# EAGLE design buttons2 (EAGLE 6.5.0)
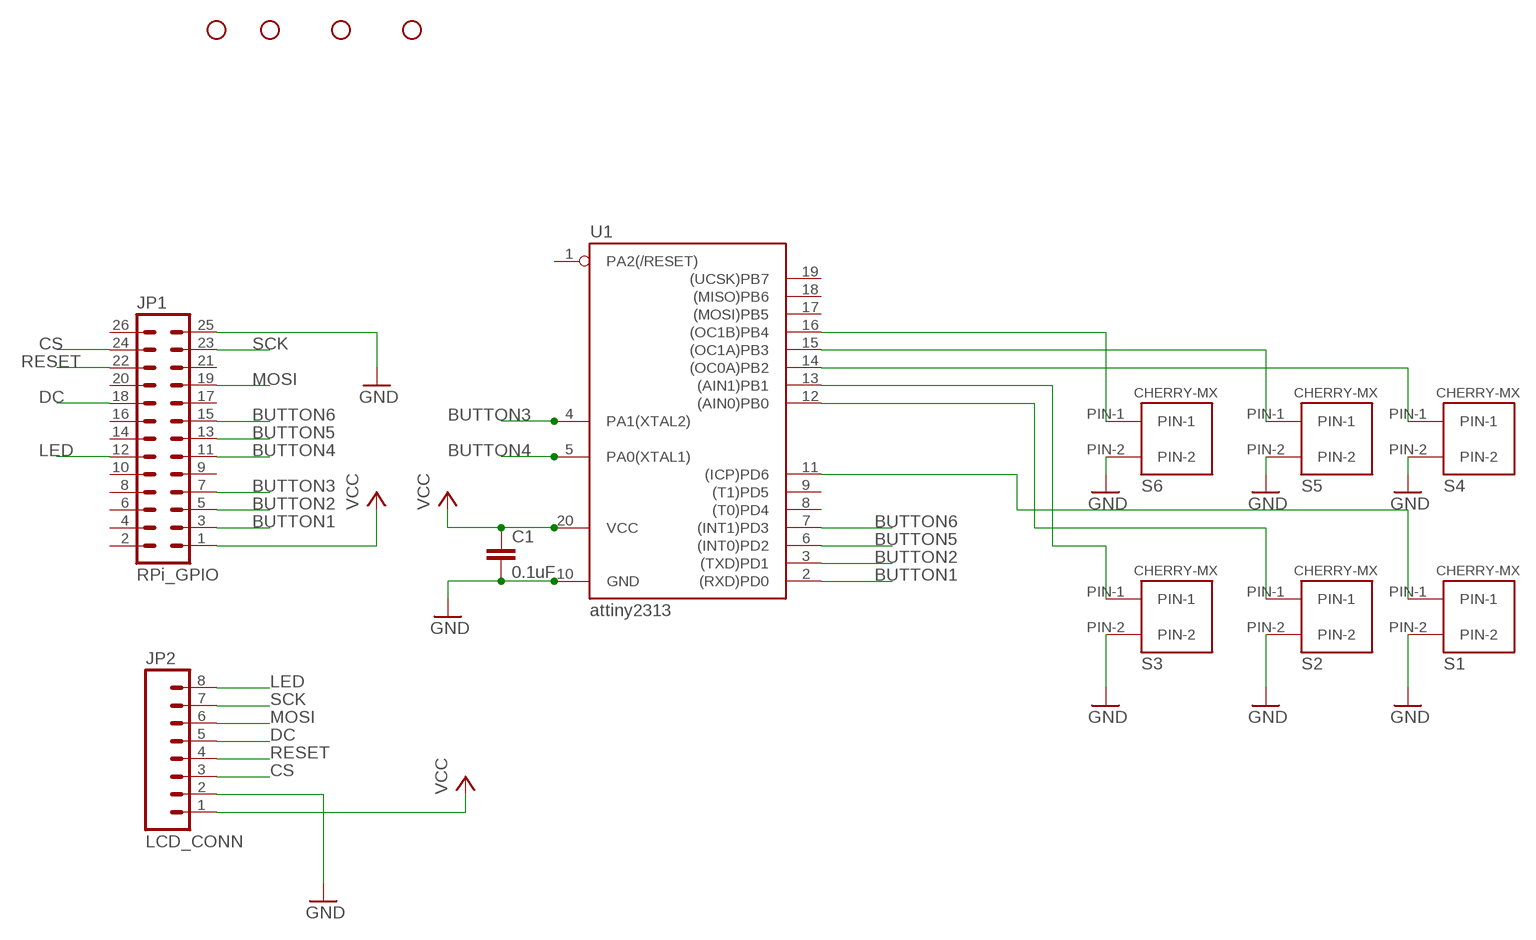
[diagram p0: schematic, sheet 1]

## Parts
C1  0.1uF  C2.5/2  [C2.5-2]
JP1  RPi_GPIO  ML26  [ML26]
JP2  LCD_CONN  M081X08  [1X08]
S1  CHERRY-MX-I  [CHERRY-MX-I]
S2  CHERRY-MX-I  [CHERRY-MX-I]
S3  CHERRY-MX-I  [CHERRY-MX-I]
S4  CHERRY-MX-I  [CHERRY-MX-I]
S5  CHERRY-MX-I  [CHERRY-MX-I]
S6  CHERRY-MX-I  [CHERRY-MX-I]
STANDOFF1  STAND-OFF  [STAND-OFF]
STANDOFF2  STAND-OFF  [STAND-OFF]
STANDOFF3  STAND-OFF  [STAND-OFF]
STANDOFF4  STAND-OFF  [STAND-OFF]
U1  attiny2313  TINY2313-*P*  [DIL20]

## Nets
BUTTON1: JP1.3 U1.2((RXD)PD0)
BUTTON2: JP1.5 U1.3((TXD)PD1)
BUTTON3: JP1.7 U1.4(PA1(XTAL2))
BUTTON4: JP1.11 U1.5(PA0(XTAL1))
BUTTON5: JP1.13 U1.6((INT0)PD2)
BUTTON6: JP1.15 U1.7((INT1)PD3)
CS: JP1.24 JP2.3
DC: JP1.18 JP2.5
GND: C1.2 JP1.25 JP2.2 S1.PIN-2 S2.PIN-2 S3.PIN-2 S4.PIN-2 S5.PIN-2 S6.PIN-2 U1.10(GND)
LED: JP1.12 JP2.8
MOSI: JP1.19 JP2.6
N$1: S6.PIN-1 U1.16((OC1B)PB4)
N$2: S5.PIN-1 U1.15((OC1A)PB3)
N$3: S4.PIN-1 U1.14((OC0A)PB2)
N$4: S3.PIN-1 U1.13((AIN1)PB1)
N$5: S2.PIN-1 U1.12((AIN0)PB0)
N$6: S1.PIN-1 U1.11((ICP)PD6)
RESET: JP1.22 JP2.4
SCK: JP1.23 JP2.7
VCC: C1.1 JP1.1 JP2.1 U1.20(VCC)
Unconnected: JP1.2 JP1.4 JP1.6 JP1.8 JP1.9 JP1.10 JP1.14 JP1.16 JP1.17 JP1.20 JP1.21 JP1.26 U1.1(PA2(/RESET)) U1.8((T0)PD4) U1.9((T1)PD5) U1.17((MOSI)PB5) U1.18((MISO)PB6) U1.19((UCSK)PB7)

## Library data of the parts
C1 = capacitor-wima:C: CAPACITOR naming: grid - package width
JP1 = con-harting-ml:ML26: HARTING; OC_FARNELL: unknown; OC_NEWARK: unknown
JP2 = SparkFun-Connectors:M08: Header 8 Standard 8-pin 0.1" header. Use with straight break away headers (SKU : PRT-00116), right angle break away headers (PRT-00553), swiss pins (PRT-00743), machine pins (PRT-00117), and female headers (PRT-00115).
S1-S6 = cherrymx:CHERRY-MX-I
STANDOFF1-STANDOFF4 = SparkFun-Electromechanical:STAND-OFF: #4 Stand Off This is the mechanical footprint for a #4 phillips button head screw. Use the keepout ring to avoid running the screw head into surrounding components. SKU : PRT-00447
U1 = avr-6:TINY2313*: Atmel Tiny2313 2K Flash, 128 bytes EEPROM, 128 bytes RAM

## Board
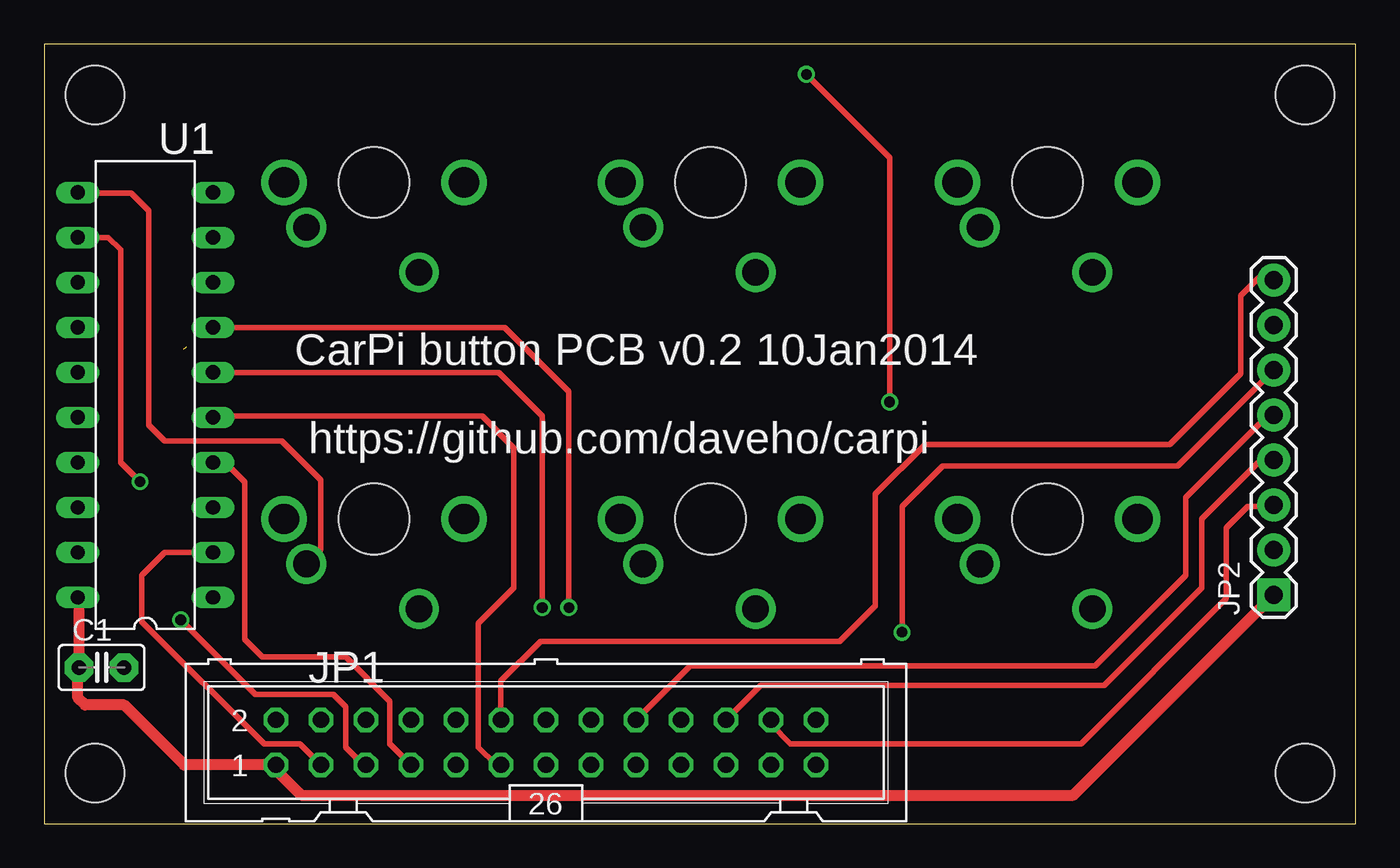
[diagram p1: board, top side]
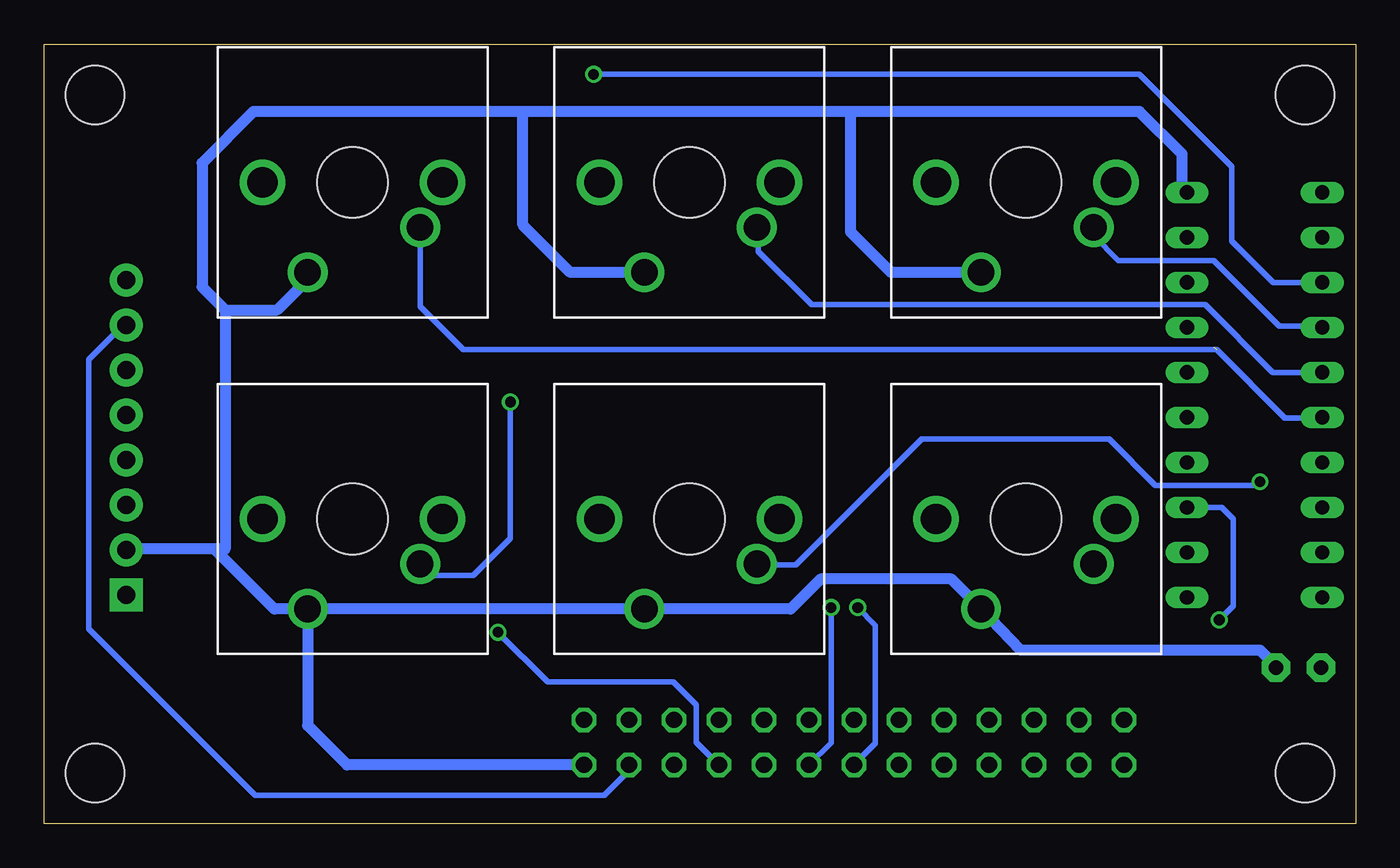
[diagram p2: board, bottom side, seen from below]

Size 74 x 44 mm. Coordinates in mm from the lower left corner, seen from the top.
Outline: 0,0 74,0 74,44 0,44 0,0
Copper layers (1*16): Top 0.0356mm / dielectric 1.5011mm / Bottom 0.0356mm
Design rules "LaenPCBOrder": minimum track width 6mil, minimum drill 13mil, track to track 6mil, track to pad 6mil, pad to pad 6mil, via to via 6mil, smd to smd 6mil, copper to edge 15mil, drill to drill 6mil, minimum pad ring 7mil, minimum via ring 7mil, stop-mask expansion 3mil, vias tented up to drill 0mil, thermal gap 10mil

### Footprints (pad centres in the part's own frame; a part is rotated, then mirrored left to right if it is on the bottom)
C2.5-2 = drill 0.813 pad 1.6 octagon: 1 -1.27,0; 2 1.27,0
ML26 = drill 0.914 octagon: 1 -15.24,-1.27; 2 -15.24,1.27; 3 -12.7,-1.27; 4 -12.7,1.27; 5 -10.16,-1.27; 6 -10.16,1.27; 7 -7.62,-1.27; 8 -7.62,1.27; 9 -5.08,-1.27; 10 -5.08,1.27; 11 -2.54,-1.27; 12 -2.54,1.27; 13 0,-1.27; 14 0,1.27; 15 2.54,-1.27; 16 2.54,1.27; 17 5.08,-1.27; 18 5.08,1.27; 19 7.62,-1.27; 20 7.62,1.27; 21 10.16,-1.27; 22 10.16,1.27; 23 12.7,-1.27; 24 12.7,1.27; 25 15.24,-1.27; 26 15.24,1.27
1X08 = drill 1.016 pad 1.88 square: 1 0,0 | drill 1.016 pad 1.88: 2 2.54,0; 3 5.08,0; 4 7.62,0; 5 10.16,0; 6 12.7,0; 7 15.24,0; 8 17.78,0
CHERRY-MX-I = drill 1.714 pad 1.778: P$3 -5.08,0; P$4 5.08,0 | drill 1.5 pad 2.184: PIN-1 -3.81,2.54; PIN-2 2.54,5.08 | hole 4: 0,0
STAND-OFF = hole 3.302: 0,0
DIL20 = drill 0.813 long: 1 -11.43,-3.81; 2 -8.89,-3.81; 3 -6.35,-3.81; 4 -3.81,-3.81; 5 -1.27,-3.81; 6 1.27,-3.81; 7 3.81,-3.81; 8 6.35,-3.81; 9 8.89,-3.81; 10 11.43,-3.81; 11 11.43,3.81; 12 8.89,3.81; 13 6.35,3.81; 14 3.81,3.81; 15 1.27,3.81; 16 -1.27,3.81; 17 -3.81,3.81; 18 -6.35,3.81; 19 -8.89,3.81; 20 -11.43,3.81

### Placement (x,y rotation side)
C1  3.23,8.81 0 top
JP1  28.31,4.58 0 top
JP2  69.38,12.91 90 top
S1  18.6,17.2 180 bottom
S2  37.6,17.2 180 bottom
S3  56.6,17.2 180 bottom
S4  18.6,36.2 180 bottom
S5  37.6,36.2 180 bottom
S6  56.6,36.2 180 bottom
STANDOFF1  71.14,2.86 0 top
STANDOFF2  2.86,2.86 0 top
STANDOFF3  71.14,41.14 0 top
STANDOFF4  2.86,41.14 0 top
U1  5.7,24.2 90 top

### Tracks (layer width: path | path; a pad name or v marks a point on that pad's centre or on a via)
BUTTON1
  Top 0.305: JP1.3 14.42,4.5 12.4,4.5 5.5,11.4 5.5,14 6.8,15.3 U1.2
BUTTON2  (via drill 0.6)
  Top 0.305: JP1.5 17.99,3.31 17,4.3 17,6.6 16.3,7.3 11.9,7.3 v7.7,11.5
  Bottom 0.305: U1.3 7.55,17.85 6.9,17.2 6.9,12.3 v7.7,11.5
BUTTON3
  Top 0.305: JP1.7 19.5,4.5 19.5,6.9 17,9.4 12.3,9.4 11.3,10.4 11.3,19.3 10.2,20.4 U1.4
BUTTON4
  Top 0.305: U1.5 9.51,22.99 9.5,23 24.7,23 26.5,21.2 26.5,13.3 24.5,11.3 24.5,4.3 25.49,3.31 JP1.11
BUTTON5  (via drill 0.6)
  Top 0.305: v28.1,12.2 28.1,23 25.63,25.47 U1.6
  Bottom 0.305: JP1.13 27.1,4.52 27.1,11.2 v28.1,12.2
BUTTON6  (via drill 0.6)
  Top 0.305: U1.7 25.99,28.01 29.6,24.4 v29.6,12.2
  Bottom 0.305: v29.6,12.2 29.6,4.56 JP1.15
CS
  Top 0.305: JP2.3 69.29,17.9 67.9,17.9 66.7,16.7 66.7,12.7 58.5,4.5 42.1,4.5 41.01,5.59 JP1.24
DC
  Top 0.305: JP2.5 69.07,23.07 64.4,18.4 64.4,14 59.3,8.9 36.44,8.9 JP1.18
GND
  Bottom 0.61: 64.4,15.5 63.8,15.5 63.8,29 | 64.4,15.5 69.33,15.5 JP2.2 | S3.PIN-2 S2.PIN-2 31.88,12.12 30.2,13.8 22.82,13.8 S1.PIN-2 18.92,9.8 5.4,9.8 4.5,8.9 C1.2 | U1.10 9.54,35.6 9.8,35.6 9.8,37.8 12.2,40.2 28.3,40.2 | JP1.25 56.91,3.31 59.14,5.54 S3.PIN-2 | 28.3,40.2 47.1,40.2 | 47.1,40.2 62.2,40.2 65.1,37.3 65.1,30.3 63.8,29 | 63.8,29 60.86,29 58.94,30.92 S6.PIN-2 | S5.PIN-2 44.32,31.12 47,33.8 47,40.1 47.1,40.2 | S4.PIN-2 26.22,31.12 28.5,33.4 28.5,40 28.3,40.2 | 64.4,15.5 61.02,12.12 S3.PIN-2
LED
  Top 0.305: JP1.12 25.77,8.07 28,10.3 44.9,10.3 46.9,12.3 46.9,18.6 49.7,21.4 63.5,21.4 67.5,25.4 67.5,29.8 68.5,30.8 69.27,30.8 JP2.8
MOSI  (via drill 0.6)
  Top 0.305: JP2.6 63.97,20.2 50.7,20.2 48.4,17.9 v48.4,10.8
  Bottom 0.305: v48.4,10.8 45.6,8 38.5,8 37.2,6.7 37.2,4.6 35.93,3.33 JP1.19
N$1  (1 unrouted)
  Bottom 0.305: U1.16 1.92,22.9 4,22.9 7.85,26.75 50.35,26.75 52.79,29.19 S6.PIN-1
N$2
  Bottom 0.305: U1.15 4.67,25.47 8.5,29.3 30.7,29.3 33.7,32.3 33.7,33.57 S5.PIN-1
N$3
  Bottom 0.305: U1.14 2.11,28.01 2.2,28.1 4.3,28.1 8,31.8 13.4,31.8 14.79,33.19 S4.PIN-1
N$4  (via drill 0.6)
  Top 0.305: v47.7,23.8 47.7,37.6 v43,42.3
  Bottom 0.305: U1.13 4.65,30.55 7,32.9 7,37.1 12.2,42.3 v43,42.3 | S3.PIN-1 52.13,14 49.8,14 47.7,16.1 v47.7,23.8
N$5  (via drill 0.6)
  Top 0.305: U1.12 3.61,33.09 4.3,32.4 4.3,20.4 v5.4,19.3
  Bottom 0.305: v5.4,19.3 5.6,19.1 11.3,19.1 13.9,21.7 24.5,21.7 31.6,14.6 33.73,14.6 S2.PIN-1
N$6
  Top 0.305: S1.PIN-1 15.6,15.47 15.6,19.4 13.4,21.6 6.8,21.6 5.9,22.5 5.9,34.6 4.9,35.6 1.92,35.6 U1.11
RESET
  Top 0.305: JP2.4 69.25,20.4 68.5,20.4 65.3,17.2 65.3,13.3 59.8,7.8 40.42,7.8 JP1.22
SCK
  Bottom 0.305: JP2.7 69.55,28.15 71.5,26.2 71.5,11 62.1,1.6 42.4,1.6 41.01,2.99 JP1.23
VCC
  Top 0.61: U1.20 1.96,12.7 C1.1 1.9,8.75 1.9,7.1 2.3,6.7 4.5,6.7 7.89,3.31 JP1.1 13.07,3.03 14.5,1.6 58.07,1.6 JP2.1

### Text on the board
tPlace: CarPi button PCB v0.2 10Jan2014 | https://github.com/daveho/carpi